# EAGLE design LNA-SMA (EAGLE 7.2.0)
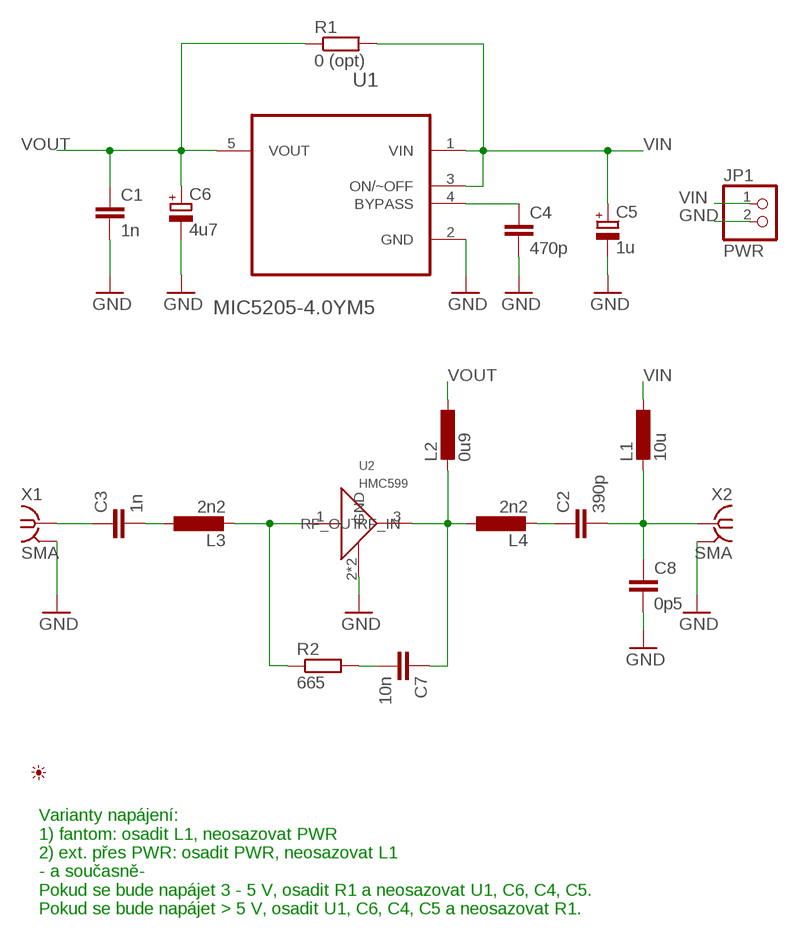
[diagram p0: schematic, sheet 1]

## Parts
C1  1n  C-EUC0603  [C0603]
C2  390p  C-EUC0603  [C0603]
C3  1n  C-EUC0603  [C0603]
C4  470p  C-EUC0603  [C0603]
C5  1u  CPOL-EUSMCA  [SMC_A]
C6  4u7  CPOL-EUSMCA  [SMC_A]
C7  10n  C-EUC0603  [C0603]
C8  0p5  C-EUC0603  [C0603]
JP1  PWR  PINHD-1X2  [1X02]
L1  10u  L-EUL2012C  [L2012C]
L2  0u9  L-EUL2012C  [L2012C]
L3  2n2  L-EUL2012C  [L2012C]
L4  2n2  L-EUL2012C  [L2012C]
R1  0 (opt)  R-EU_R0603  [R0603]
R2  665  R-EU_R0603  [R0603]
U1  MIC5205-4.0YM5  LP2985A-18DBVJ  [SOT95P280X145-5N]
U2  HMC599  [SOT89]
U$1  PICTO_1  [PICTO_1]
X1  SMA  SMA-142-0701-801/806  [J502-ND-142-0701-801/806]
X2  SMA  SMA-142-0701-801/806  [J502-ND-142-0701-801/806]

## Nets
GND: C1.2 C4.2 C5.- C6.- C8.2 JP1.2 U1.2(GND) U2.2(GND) U2.2.1(GND) X1.G@1 X1.G@2 X1.G@3 X1.G@4 X2.G@1 X2.G@2 X2.G@3 X2.G@4
N$1 [net]: C4.1 U1.4(BYPASS)
N$2 [RF]: C3.2 L3.1
N$3 [RF]: C2.1 L4.2
N$4 [RF]: L3.2 R2.1 U2.1(RF_IN)
N$5 [RF]: C7.1 L2.2 L4.1 U2.3(RF_OUT)
N$6 [RF]: C7.2 R2.2
RF_IN [RF]: C2.2 C8.1 L1.2 X2.1
RF_OUT [RF]: C3.1 X1.1
VIN [net]: C5.+ JP1.1 L1.1 R1.2 U1.1(VIN) U1.3(ON/~OFF)
VOUT [net]: C1.1 C6.+ L2.1 R1.1 U1.5(VOUT)

## Notes on the sheet
- Varianty napájení:
  1) fantom: osadit L1, neosazovat PWR
  2) ext. přes PWR: osadit PWR, neosazovat L1
  - a současně-
  Pokud se bude napájet 3 - 5 V, osadit R1 a neosazovat U1, C6, C4, C5.
  Pokud se bude napájet > 5 V, osadit U1, C6, C4, C5 a neosazovat R1.

## Library data of the parts
C1-C4 C7 C8 = rcl:C-EU: CAPACITOR, European symbol
C5 C6 = rcl:CPOL-EU: POLARIZED CAPACITOR, European symbol
JP1 = pinhead:PINHD-1X2: PIN HEADER
L1-L4 = rcl:L-EU: INDUCTOR, European symbol
R1 R2 = rcl:R-EU_: RESISTOR, European symbol
U1 = Texas Instruments_By_element14_Batch_1:LP2985A-18DBVJ: 150-mA LOW-NOISE LOW-DROPOUT REGULATOR; MPN: LP2985A-18DBVJ; OC_FARNELL: 1924808; OC_NEWARK: 58T1987; PACKAGE: SOT-23-5; SUPPLIER: Texas Instruments
U2 = INF-SOT343_V:HMC599: AD (Hittite) HMC599
U$1 = My_Picto:PICTO_1: Zdenek Brichacek; OK3ZB; http://blog.brichacek.net
X1 X2 = con-coax:SMA-: SMA 50 Ohm End Launch Jack Receptacle - Round Contact Johnson Components Source: www.johnsoncomponents.com .. J502-ND.pdf; MF: JOHNSON COMPONENTS; MPN: 142-0701-801; OC_FARNELL: 1608592; OC_NEWARK: 90F2624

## Net classes
1 RF: width 2.5 mm, clearance 0.508 mm
2 net: width 0.6 mm, clearance 0.254 mm

## Board
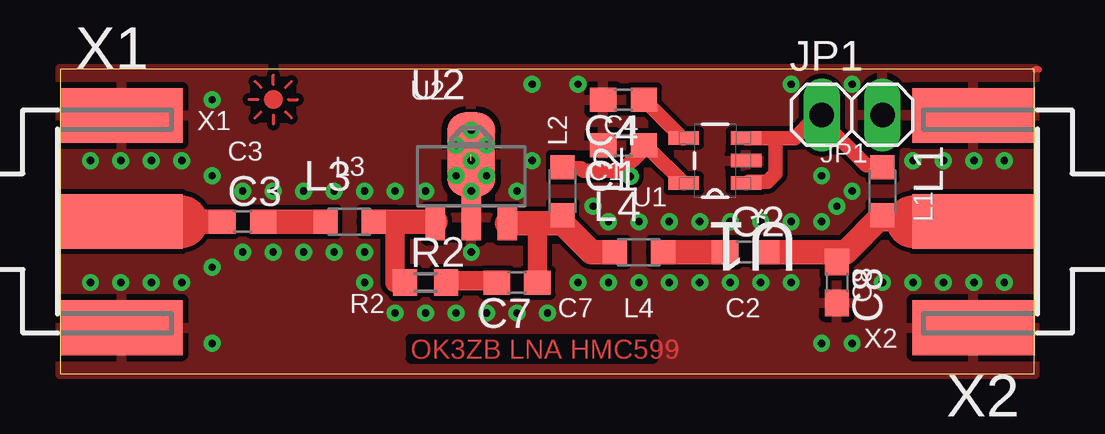
[diagram p1: board, top side]
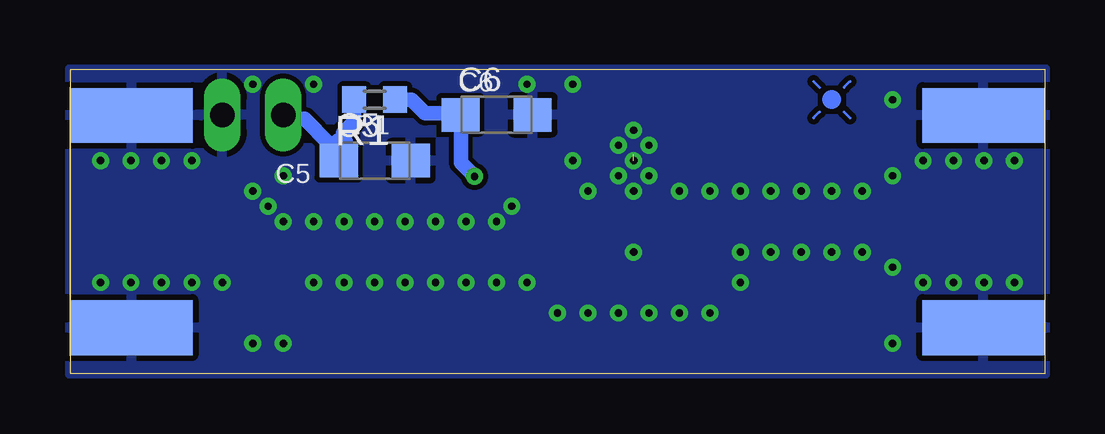
[diagram p2: board, bottom side, seen from below]

Size 40.64 x 12.7 mm. Coordinates in mm from the lower left corner, seen from the top.
Outline: 0,0 40.62,0 40.62,12.7 0,12.7 0,0
Copper layers (1*16): Top 0.035mm / dielectric 1.5mm / Bottom 0.035mm
Design rules "default *": minimum track width 10mil, minimum drill 24mil, track to track 8mil, track to pad 8mil, pad to pad 8mil, via to via 8mil, smd to smd 8mil, copper to edge 0mil, drill to drill 8mil, minimum pad ring 10mil, minimum via ring 8mil, stop-mask expansion 4mil, vias tented up to drill 0mil, thermal gap 10mil

### Footprints (pad centres in the part's own frame; a part is rotated, then mirrored left to right if it is on the bottom)
C0603 = smd 1.1 x 1: 1 -0.85,0; 2 0.85,0
SMC_A = smd 1.6 x 1.4: + -1.5,0; - 1.5,0
1X02 = drill 1.016 long: 1 -1.27,0; 2 1.27,0
L2012C = smd 1 x 1: 1 -1,0; 2 1,0
R0603 = smd 1 x 1.1: 1 -0.85,0; 2 0.85,0
SOT95P280X145-5N = smd 1.27 x 0.559: 1 -1.295,0.94; 2 -1.295,0; 3 -1.295,-0.94; 4 1.295,-0.94; 5 1.295,0.94
SOT89 = smd 0.8 x 1.4: 1 -1.499,-1.981; 3 1.499,-1.981 | smd 0.8 x 1.9: 2 0,-1.727 | smd 2 x 3.5: 2.1 0,0.889
J502-ND-142-0701-801/806 = smd 5.08 x 2.286: 1 2.565,0; G@1 2.565,4.42; G@2 2.565,-4.42 | smd 5.08 x 2.286 bottom: G@3 2.565,4.42; G@4 2.565,-4.42

### Placement (x,y rotation side)
C1  23.5,9.53 180 top
C2  28.57,5.08 0 top
C3  7.62,6.35 0 top
C4  23.5,11.43 180 top
C5  27.94,8.89 0 bottom
C6  22.86,10.79 0 bottom
C7  19.05,3.81 180 top
C8  32.38,3.81 270 top
JP1  33.02,10.79 0 top
L1  34.29,7.62 270 top
L2  20.95,7.62 270 top
L3  12.06,6.35 0 top
L4  24.13,5.08 0 top
R1  27.94,11.43 180 bottom
R2  15.24,3.81 0 top
U1  27.3,8.89 180 top
U2  17.14,8.26 0 top
U$1  8.89,11.43 0 top
X1  0,6.35 0 top
X2  40.64,6.35 180 top

### Tracks (layer width: path | path; a pad name or v marks a point on that pad's centre or on a via)
GND  (via drill 0.3)  (1 unrouted)
  Top 0.254: 37.95,11.09 X2.G@4 | 40.8,12.69 40.64,12.69
  other vias: 30.48,12.06 17.14,7.62 16.51,8.26 17.78,8.26 16.51,9.53 17.78,9.53 17.14,8.89 17.14,10.16 17.14,5.08 1.27,8.89 2.54,8.89 3.81,8.89 5.08,8.89 1.27,3.81 2.54,3.81 3.81,3.81 5.08,3.81 6.35,4.45 6.35,8.26 7.62,7.62 8.89,7.62 10.16,7.62 11.43,7.62 12.7,7.62 13.97,7.62 15.24,7.62 7.62,5.08 8.89,5.08 10.16,5.08 11.43,5.08 12.7,5.08 12.7,3.81 6.35,11.43 6.35,1.27 13.97,2.54 15.24,2.54 16.51,2.54 17.78,2.54 19.05,2.54 20.32,2.54 21.59,3.81 22.86,3.81 24.13,3.81 25.4,3.81 26.67,3.81 27.94,3.81 29.21,3.81 30.48,3.81 31.75,1.27 33.02,1.27 34.29,3.81 35.56,3.81 36.83,3.81 38.1,3.81 39.37,3.81 39.37,8.89 38.1,8.89 36.83,8.89 35.56,8.89 33.02,7.62 32.38,6.99 31.75,6.35 30.48,6.35 29.21,6.35 27.94,6.35 26.67,6.35 25.4,6.35 24.13,6.35 22.86,6.35 22.23,6.99 19.05,7.62 19.68,8.89 19.68,12.06 21.59,12.06 31.75,8.26 33.02,12.06
  pour Top: 0,12.7 0,0 40.64,0 40.64,12.7
  pour Bottom: 0,12.7 0,0 40.64,0 40.64,12.7
N$1
  Top 0.6: C4.1 25.95,9.83 U1.4
N$2
  Top 1.016: C3.2 L3.1
N$3
  Top 1.016: L4.2 C2.1
N$4
  Top 0.813: 15.65,6.35 U2.1 | R2.1 13.97,3.81 13.97,6.35
  Top 1.016: L3.2 13.97,6.35 15.65,6.35
N$5
  Top 0.813: 20.95,6.27 L2.2 | U2.3 19.9,6.27 C7.1
  Top 1.016: U2.3 20.95,6.27 22.15,5.08 L4.1
N$6
  Top 0.254: 16.12,3.89 R2.2 | 18.17,3.89 C7.2
  Top 0.813: 18.17,3.89 16.12,3.89
RF_IN
  Top 0.813: 35.56,6.35 34.29,6.35 L1.2 | 32.75,5.08 32.38,4.71 C8.1
  Top 1.016: L1.2 32.75,5.08 C2.2
  Top 2.184: X2.1 35.56,6.35
RF_OUT
  Top 1.016: 5.08,6.35 C3.1
  Top 2.184: X1.1 5.08,6.35
VIN
  Top 0.6: 29.83,9.83 30.63,9.83 31.43,10.63 JP1.1 31.77,10.52 33.6,8.69 34.29,8.69 L1.1 | 29.83,9.83 U1.3 | 29.83,9.83 29.83,8.34 29.49,8 28.69,8 U1.1
  Bottom 0.6: 29.26,9.83 29.26,10.06 28.8,10.52 28.8,11.43 R1.2 | 29.26,9.83 29.15,9.72 29.15,9.14 29.38,8.91 C5.+ | 29.26,9.83 29.49,9.72 29.6,9.6 29.83,9.6 30.86,10.63 31.55,10.63 31.66,10.74 JP1.1
VOUT  (via drill 0.3)
  Top 0.6: 23.43,8.46 21.83,8.46 21.72,8.57 21.03,8.57 L2.1 | 23.43,8.46 24.23,9.26 24.23,9.49 C1.1 24.57,9.37 25.95,8 U1.5 | v23.77,8.23 23.66,8.34 23.43,8.46
  Bottom 0.6: R1.1 26.4,11.43 25.83,10.86 24.46,10.86 C6.+ 24.35,10.52 24.35,8.8 v23.77,8.23

### Text on the board
Top: OK3ZB LNA HMC599
_tNames: U2 | L2 | C4 | X1 | C3 | C1 | JP1 | L3 | L1 | U1 | C8 | R2 | C7 | L4 | C2 | X2
_bNames: C6 | R1 | C5